# Altium project EMS_Testing_Circuit.PrjPcb
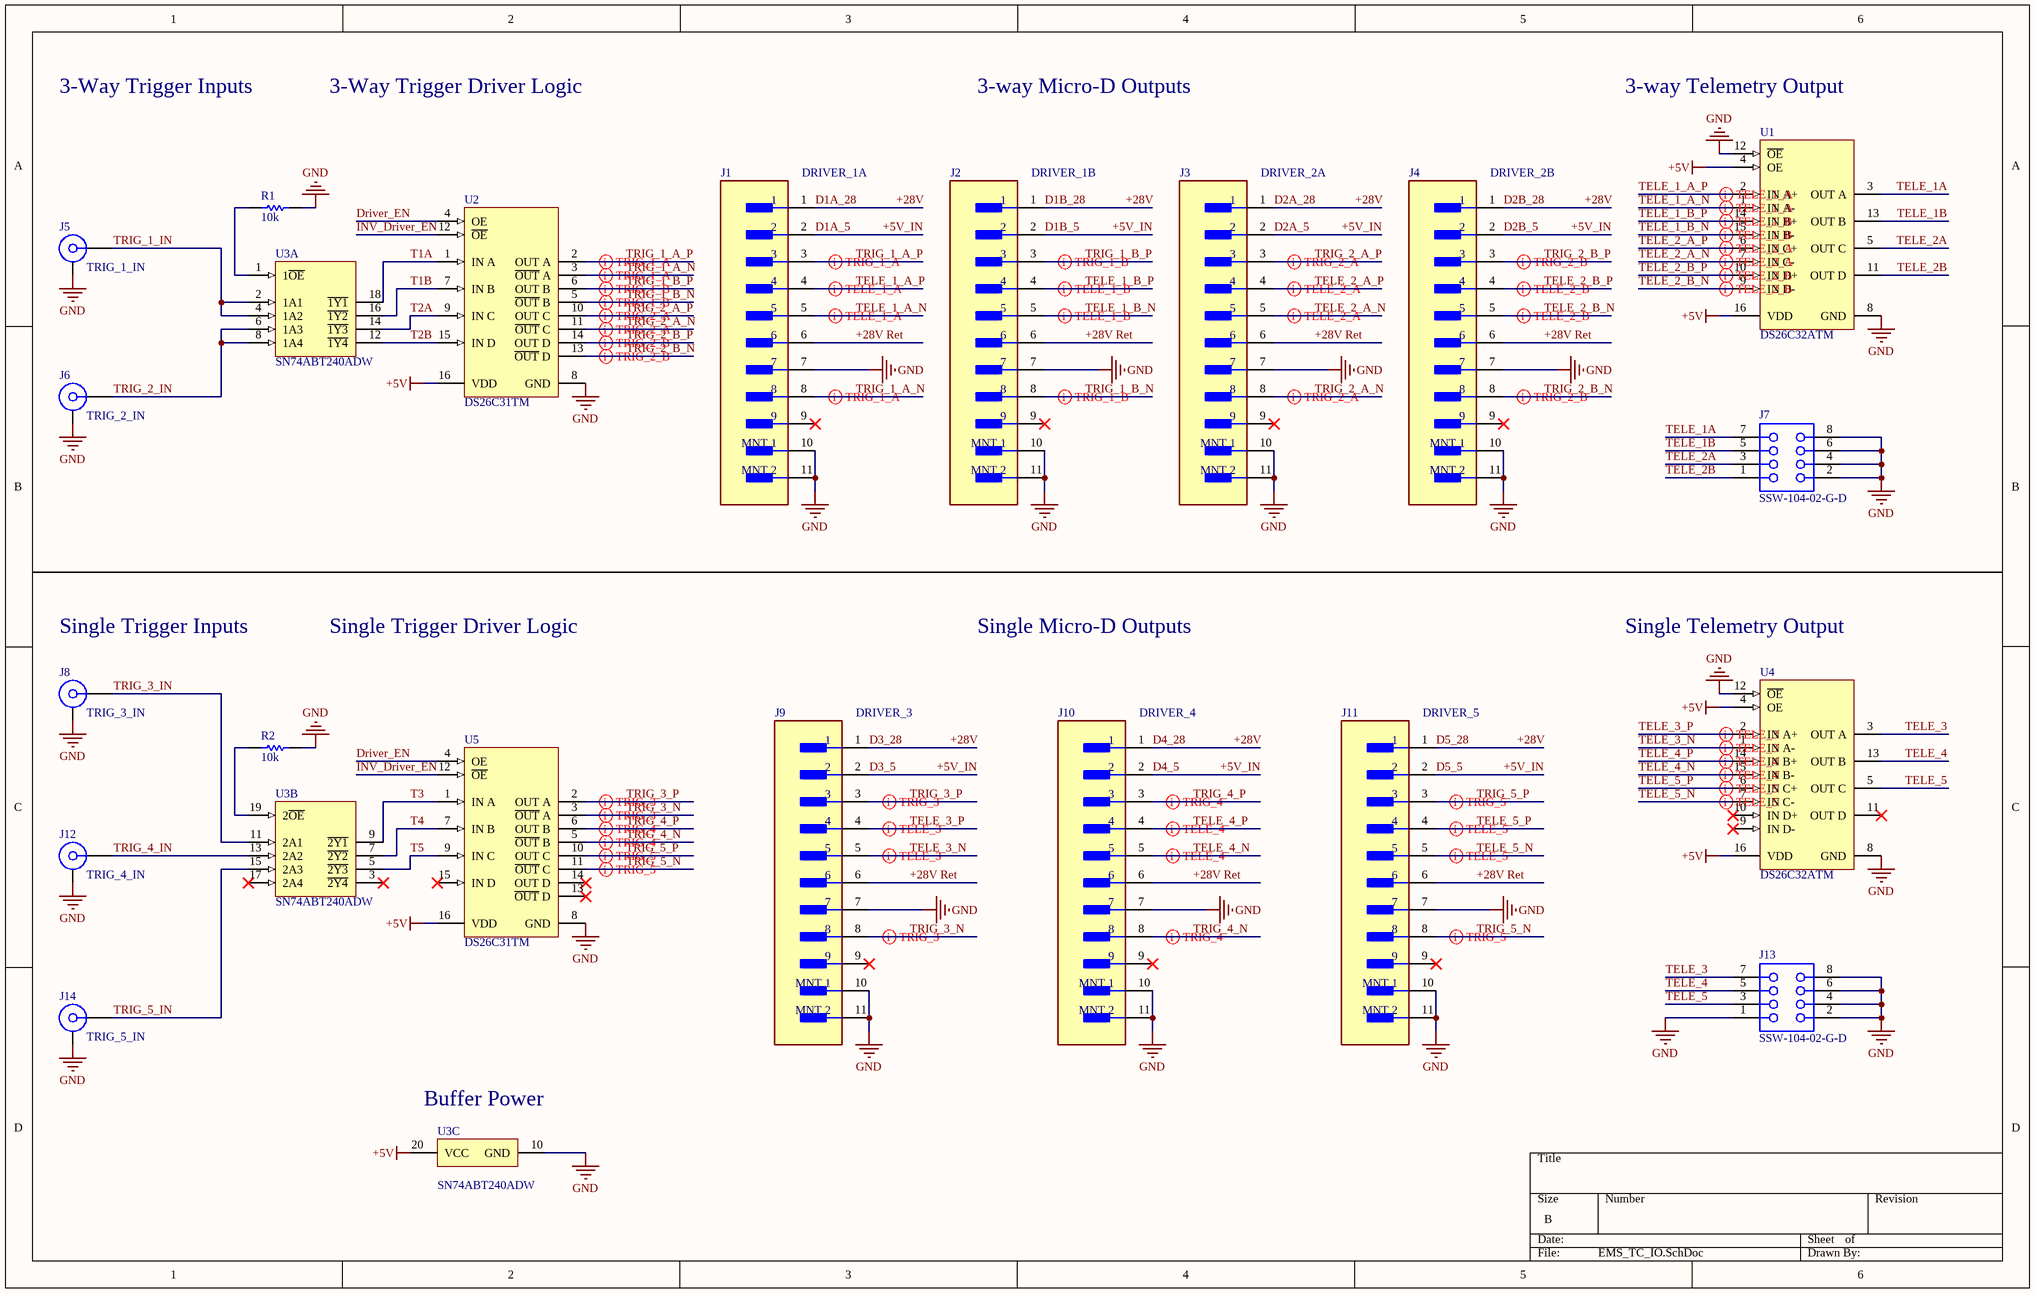
[diagram p0: EMS_TC_IO.SchDoc]
2 sheets, 64 parts. Net scope: global (net labels, ports and power ports of the same name join across sheets).
Board file: EMS_TC_PCB_V2.PcbDoc
Sheets:
  EMS_TC_IO.SchDoc
  EMS_TC_PWR.SchDoc

## Sheet EMS_TC_IO.SchDoc
size B; SheetNumber: 1; SheetTotal: 2

### Parts
J1  DRIVER_1A  [FP-381-009-112L565-MFG]
J2  DRIVER_1B  [FP-381-009-112L565-MFG]
J3  DRIVER_2A  [FP-381-009-112L565-MFG]
J4  DRIVER_2B  [FP-381-009-112L565-MFG]
J5  TRIG_1_IN  [ROS-51K204-400A5_V]
J6  TRIG_2_IN  [ROS-51K204-400A5_V]
J7  SSW-104-02-G-D  [SMTC-SSW-104-02-X-D]
J8  TRIG_3_IN  [ROS-51K204-400A5_V]
J9  DRIVER_3  [FP-381-009-112L565-MFG]
J10  DRIVER_4  [FP-381-009-112L565-MFG]
J11  DRIVER_5  [FP-381-009-112L565-MFG]
J12  TRIG_4_IN  [ROS-51K204-400A5_V]
J13  SSW-104-02-G-D  [SMTC-SSW-104-02-X-D]
J14  TRIG_5_IN  [ROS-51K204-400A5_V]
R1  10k  [RESC3116X65X40ML10T20]
R2  10k  [RESC3116X65X40ML10T20]
U1  DS26C32ATM  [D0016A_L]
U2  DS26C31TM  [D0016A_L]
U3  SN74ABT240ADW  [DW0020A_N]  (parts A,B,C of 3)
U4  DS26C32ATM  [D0016A_L]
U5  DS26C31TM  [D0016A_L]

### Nets
+5V_IN: J1.2 J2.2 J3.2 J4.2 J9.2 J10.2 J11.2 U1.4(OE) U1.16(VDD) U2.16(VDD) U3.20(VCC) U4.4(OE) U4.16(VDD) U5.16(VDD)  [also labelled +5V, D1A_5, D1B_5, D2A_5, D2B_5, D3_5, D4_5, D5_5]
+28V: J1.1 J2.1 J3.1 J4.1 J9.1 J10.1 J11.1  [also labelled D1A_28, D1B_28, D2A_28, D2B_28, D3_28, D4_28, D5_28]
+28V Ret: J1.6 J2.6 J3.6 J4.6 J9.6 J10.6 J11.6
GND: J1.7 J1.10(MNT_1) J1.11(MNT_2) J2.7 J2.10(MNT_1) J2.11(MNT_2) J3.7 J3.10(MNT_1) J3.11(MNT_2) J4.7 J4.10(MNT_1) J4.11(MNT_2) J5.MH J6.MH J7.2 J7.4 J7.6 J7.8 J8.MH J9.7 J9.10(MNT_1) J9.11(MNT_2) J10.7 J10.10(MNT_1) J10.11(MNT_2) J11.7 J11.10(MNT_1) J11.11(MNT_2) J12.MH J13.1 J13.2 J13.4 J13.6 J13.8 J14.MH R1.2 R2.2 U1.8(GND) U1.12(~{OE}) U2.8(GND) U3.10(GND) U4.8(GND) U4.12(~{OE}) U5.8(GND)
Driver_EN: U2.4(OE) U5.4(OE)
INV_Driver_EN: U2.12(~{OE}) U5.12(~{OE})
T1A: U2.1(IN_A) U3.18(~{1Y1})
T1B: U2.7(IN_B) U3.16(~{1Y2})
T2A: U2.9(IN_C) U3.14(~{1Y3})
T2B: U2.15(IN_D) U3.12(~{1Y4})
T3: U3.9(~{2Y1}) U5.1(IN_A)
T4: U3.7(~{2Y2}) U5.7(IN_B)
T5: U3.5(~{2Y3}) U5.9(IN_C)
TELE_1_A_N: J1.5 U1.1(IN_A-)
TELE_1_A_P: J1.4 U1.2(IN_A+)
TELE_1_B_N: J2.5 U1.15(IN_B-)
TELE_1_B_P: J2.4 U1.14(IN_B+)
TELE_1A: J7.7 U1.3(OUT_A)
TELE_1B: J7.5 U1.13(OUT_B)
TELE_2_A_N: J3.5 U1.7(IN_C-)
TELE_2_A_P: J3.4 U1.6(IN_C+)
TELE_2_B_N: J4.5 U1.9(IN_D-)
TELE_2_B_P: J4.4 U1.10(IN_D+)
TELE_2A: J7.3 U1.5(OUT_C)
TELE_2B: J7.1 U1.11(OUT_D)
TELE_3: J13.7 U4.3(OUT_A)
TELE_3_N: J9.5 U4.1(IN_A-)
TELE_3_P: J9.4 U4.2(IN_A+)
TELE_4: J13.5 U4.13(OUT_B)
TELE_4_N: J10.5 U4.15(IN_B-)
TELE_4_P: J10.4 U4.14(IN_B+)
TELE_5: J13.3 U4.5(OUT_C)
TELE_5_N: J11.5 U4.7(IN_C-)
TELE_5_P: J11.4 U4.6(IN_C+)
TRIG_1_A_N: J1.8 U2.3(~{OUT}_A)
TRIG_1_A_P: J1.3 U2.2(OUT_A)
TRIG_1_B_N: J2.8 U2.5(~{OUT}_B)
TRIG_1_B_P: J2.3 U2.6(OUT_B)
TRIG_1_IN: J5.1 U3.2(1A1) U3.4(1A2)
TRIG_2_A_N: J3.8 U2.11(~{OUT}_C)
TRIG_2_A_P: J3.3 U2.10(OUT_C)
TRIG_2_B_N: J4.8 U2.13(~{OUT}_D)
TRIG_2_B_P: J4.3 U2.14(OUT_D)
TRIG_2_IN: J6.1 U3.6(1A3) U3.8(1A4)
TRIG_3_IN: J8.1 U3.11(2A1)
TRIG_3_N: J9.8 U5.3(~{OUT}_A)
TRIG_3_P: J9.3 U5.2(OUT_A)
TRIG_4_IN: J12.1 U3.13(2A2)
TRIG_4_N: J10.8 U5.5(~{OUT}_B)
TRIG_4_P: J10.3 U5.6(OUT_B)
TRIG_5_IN: J14.1 U3.15(2A3)
TRIG_5_N: J11.8 U5.11(~{OUT}_C)
TRIG_5_P: J11.3 U5.10(OUT_C)
NetR1_1: R1.1 U3.1(1~{OE})
NetR2_1: R2.1 U3.19(2~{OE})

Not connected (* = marked no-connect by the designer): J1 9*; J2 9*; J3 9*; J4 9*; J9 9*; J10 9*; J11 9*; U3 3(~{2Y4})* 17(2A4)*; U4 9(IN_D-)* 10(IN_D+)* 11(OUT_D)*; U5 13(~{OUT}_D)* 14(OUT_D)* 15(IN_D)*

### Layout directives
differential pair; differential pair class TRIG_1_A; rule Differential Pairs Routing [Pref Gap = 6mil    Min Gap  = 6mil    Max Gap  = 10milPref Width = 6mil    Min Width  = 6mil    Max Width  = 15mil]: TRIG_1_A_N, TRIG_1_A_P
differential pair; rule Differential Pairs Routing [Pref Gap = 6mil    Min Gap  = 6mil    Max Gap  = 10milPref Width = 6mil    Min Width  = 6mil    Max Width  = 15mil]; differential pair class TRIG_1_B: TRIG_1_B_N, TRIG_1_B_P
differential pair; rule Differential Pairs Routing [Pref Gap = 6mil    Min Gap  = 6mil    Max Gap  = 10milPref Width = 6mil    Min Width  = 6mil    Max Width  = 15mil]; differential pair class TRIG_2_A: TRIG_2_A_N, TRIG_2_A_P
differential pair; rule Differential Pairs Routing [Pref Gap = 6mil    Min Gap  = 6mil    Max Gap  = 10milPref Width = 6mil    Min Width  = 6mil    Max Width  = 15mil]; differential pair class TRIG_2_B: TRIG_2_B_N, TRIG_2_B_P
differential pair; rule Differential Pairs Routing [Pref Gap = 6mil    Min Gap  = 6mil    Max Gap  = 10milPref Width = 6mil    Min Width  = 6mil    Max Width  = 15mil]; differential pair class TELE_1_A: TELE_1_A_N, TELE_1_A_P
differential pair; rule Differential Pairs Routing [Pref Gap = 6mil    Min Gap  = 6mil    Max Gap  = 10milPref Width = 6mil    Min Width  = 6mil    Max Width  = 15mil]; differential pair class TELE_1_B: TELE_1_B_N, TELE_1_B_P
differential pair; differential pair class TELE_2_A; rule Differential Pairs Routing [Pref Gap = 6mil    Min Gap  = 6mil    Max Gap  = 10milPref Width = 6mil    Min Width  = 6mil    Max Width  = 15mil]: TELE_2_A_N, TELE_2_A_P
differential pair; rule Differential Pairs Routing [Pref Gap = 6mil    Min Gap  = 6mil    Max Gap  = 10milPref Width = 6mil    Min Width  = 6mil    Max Width  = 15mil]; differential pair class TELE_2_B: TELE_2_B_N, TELE_2_B_P
differential pair; rule Differential Pairs Routing [Pref Gap = 6mil    Min Gap  = 6mil    Max Gap  = 10milPref Width = 6mil    Min Width  = 6mil    Max Width  = 15mil]; differential pair class TRIG_3: TRIG_3_N, TRIG_3_P
differential pair; rule Differential Pairs Routing [Pref Gap = 6mil    Min Gap  = 6mil    Max Gap  = 10milPref Width = 6mil    Min Width  = 6mil    Max Width  = 15mil]; differential pair class TRIG_4: TRIG_4_N, TRIG_4_P
differential pair; differential pair class TRIG_5; rule Differential Pairs Routing [Pref Gap = 6mil    Min Gap  = 6mil    Max Gap  = 10milPref Width = 6mil    Min Width  = 6mil    Max Width  = 15mil]: TRIG_5_N, TRIG_5_P
differential pair; differential pair class TELE_3; rule Differential Pairs Routing [Pref Gap = 6mil    Min Gap  = 6mil    Max Gap  = 10milPref Width = 6mil    Min Width  = 6mil    Max Width  = 15mil]: TELE_3_N, TELE_3_P
differential pair; differential pair class TELE_4; rule Differential Pairs Routing [Pref Gap = 6mil    Min Gap  = 6mil    Max Gap  = 10milPref Width = 6mil    Min Width  = 6mil    Max Width  = 15mil]: TELE_4_N, TELE_4_P
differential pair; differential pair class TELE_5; rule Differential Pairs Routing [Pref Gap = 6mil    Min Gap  = 6mil    Max Gap  = 10milPref Width = 6mil    Min Width  = 6mil    Max Width  = 15mil]: TELE_5_N, TELE_5_P

### Notes on the sheet
- 3-Way Trigger Inputs
- 3-Way Trigger Driver Logic
- 3-way Micro-D Outputs
- 3-way Telemetry Output
- Single Trigger Inputs
- Single Trigger Driver Logic
- Single Micro-D Outputs
- Single Telemetry Output
- (near U3) Buffer Power

### Library data of the parts
J1-J4 J9-J11 = CMP-42562-000005-1: CONN MICRO-D PLUG 9POS R/A SLDR; Manufacturer Part Number: 381-009-112L565; Manufacturer: NorComp Inc.; Conn Orientation: Right Angle; Voltage Rating: 500V; Conn Gender: Male; Number Of Contacts: 9; Shielding: true; Pitch: 1.27mm; Current Rating: 1A; RoHS: TRUE; Temperature Range Low: -55°C; Digikey Description: CONN MICRO-D PLUG 9POS R/A SLDR; ComponentLink2Description: Datasheet; Category: Conn; Octopart: https://octopart.com/381-009-112l565-norcomp-21388372; Automotive: No; Device Class L3: unset; Package: 381-009-112L565; Height: 8.003mm; Device Class L2: D-Sub Connectors; ComponentLink2URL: https://www.norcomp.net/rohspdfs/Micro-D/381-009-112L565.pdf; Contact Material: Gold,Nickel; Mouser Description: D-Sub Micro-D Connectors MICRO-D 9P R/A W/ STNDOFF/BRDLK; Temperature: -55°C to +85°C; Temperature Range High: +85°C; Device Class L1: Connectors; Lead Free: Yes
J5 J6 J8 J12 J14 = CMP-0753-00004-1: BNC 50R Right Angle Jack, Panel Feedthrough, Up to 10 GHz, -55 to 155 degC; PartNumber: 51K204-400A5; Manufacturer: Rosenberger; Design Note: Footprint in library is a generic example - only application specific footprint delivers High Performance; PackageReference: 51K204-400A5; DatasheetVersion: d00; ComponentLink2Description: Datasheet; ComponentLink5Description: Webshop / RFQ; ComponentLink1URL: http://www.rosenberger.de; ComponentLink4URL: http://rosenberger.de/ok/images/documents/spez/51.pdf; PackageVersion: d00; ComponentLink5URL: http://www.rosenberger.com/en/contact/sales/; ComponentLink3URL: http://rosenberger.de/ok/images/documents/db/51K204-400A5.pdf; ComponentLink2URL: http://rosenberger.de/ok/images/documents/db/51K204-400A5.pdf; ComponentLink1Description: Manufacturer URL; Mounting Technology: Through Hole; PackageDescription: 50R BNC Right Angle Jack, 12.5 x 32.6 x 14.5 mm; ComponentLink4Description: Series Overview / Design Note; ComponentLink3Description: Package Specification
J7 J13 = CMP-1023-00343-1: SQ Post Socket, Through-hole, Vertical, -55 to 125 degC, 2.54mm Pitch, 8-Pin, Female, RoHS; Manufacturer: Samtec; Mounting Technology: Through-hole; ComponentLink1Description: Manufacturer URL; Orientation: Vertical; Pitch: 2.54 mm; PartNumber: SSW-104-02-G-D; ComponentLink2URL: http://www.samtec.com/documents/webfiles/pdf/SSW_TH.PDF; PackageReference: SSW-104-02-X-D; ComponentLink3Description: Package Specification; PackageVersion: CA, 6/1987; PackageDescription: Assembly, Socket Strip .016 X .031 Tail; ComponentLink2Description: Datasheet; RoHS: True; ComponentLink1URL: http://www.samtec.com; ComponentLink3URL: http://www.samtec.com/documents/webfiles/cpdf/SSW-1XX-XX-XXX-X-XX-XXX-XX-MKT.pdf; DatasheetVersion: F-214; Temperature Range: -55 to 125 degC
R1 R2 = CMP-1014-00623-2: Chip Resistor, 10 KOhm, +/- 1%, 0.25 W, -55 to 155 degC, 1206 (3216 Metric), RoHS, Tape and Reel; Manufacturer: Yageo; Voltage Rating: 200V; Resistance: 10KOhm; Temperature Coefficient: 100ppm/degreesC; Power Rating: 250mW; Packaging: TapeandReel; Termination: SMD/SMT; REACH SVHC: Unknown; Tolerance: 1%; Height: 0.55mm; Composition: ThickFilm; Max Operating Temperature: 155degC; Datasheet Version: Rev. 5, 10/2016; Lead Free: LeadFree; Case Code (Metric): 3216; Depth: 1.6mm; Package Quantity: 5000; RoHSCompliant: true; Military Standard: Not; Case/Package: 1206; Case Code (Imperial): 1206; Min Operating Temperature: -55degC; Datasheet URL: http://www.yageo.com/NewPortal/yageodocoutput?fileName=/pdf/R-Chip/PYu-RC_Group_51_RoHS_L_5.pdf; Length: 3.1mm; Manufacturer URL: http://www.yageo.com/; Package Reference: 1206.0; Width: 1.6mm; Package Description: 2-Pin Surface Mount Device, Body 3.1 x 1.6 mm
U1 U4 = CMP-0058-00986-3: CMOS Quad Differential Line Receiver, 16-pin Narrow SOIC; Manufacturer: Texas Instruments; CompType: Interface IC; PowerWise: N; PackageTopMarking: NSUZXYTTE#*DS26C32ATM; Code_JEDEC: MS-012-AC; ComponentLink1Description: Datasheet URL; RoHS: N; Code_IPC: SOIC127P600-16; PackageReference: D0016A; PinCount: 16; ComponentLink1URL: http://www.ti.com/general/docs/lit/getliterature.tsp?genericPartNumber=DS26C32AT&fileType=pdf; PackageDescription: Molded Package, SO, .150in Wide, 16 Lead
U2 U5 = CMP-0058-00990-3: CMOS Quad Tri-State Differential Line Driver, 16-pin Narrow SOIC; Manufacturer: Texas Instruments; CompType: Interface IC; PackageTopMarking: NSUZXYTTE#*DS26C31TM; PowerWise: N; PinCount: 16; ComponentLink1URL: http://www.ti.com/general/docs/lit/getliterature.tsp?genericPartNumber=DS26C31T&fileType=pdf; PackageDescription: Molded Package, SO, .150in Wide, 16 Lead; Code_JEDEC: MS-012-AC; ComponentLink1Description: Datasheet URL; RoHS: N; Code_IPC: SOIC127P600-16; PackageReference: D0016A
U3 = CMP-1615-00030-3: Octal Buffers/Drivers With 3-State Outputs, DW0020A, TUBE; Manufacturer: Texas Instruments; Schmitt Trigger: No; Voltage(Nom)(V): 5; VCC(Max)(V): 5.5; Input Type: TTL; tpd @ Nom Voltage(Max)(ns): 4.8; Bits(#): 8; Rating: Catalog; F @ Nom Voltage(Max)(Mhz): 150; Output Drive (IOL/IOH)(Max)(mA): -32/64; ICC @ Nom Voltage(Max)(mA): 0.0055; VCC(Min)(V): 4.5; Technology Family: ABT; PackageReference: DW0020A; Generic Part Number: SN74ABT240A; Code_JEDEC: MS-013; DatasheetVersion: SCBS098I; Operating Temperature Range(C): -40 to 85; Output Type: TTL

## Sheet EMS_TC_PWR.SchDoc
size B; SheetNumber: 2; SheetTotal: 2
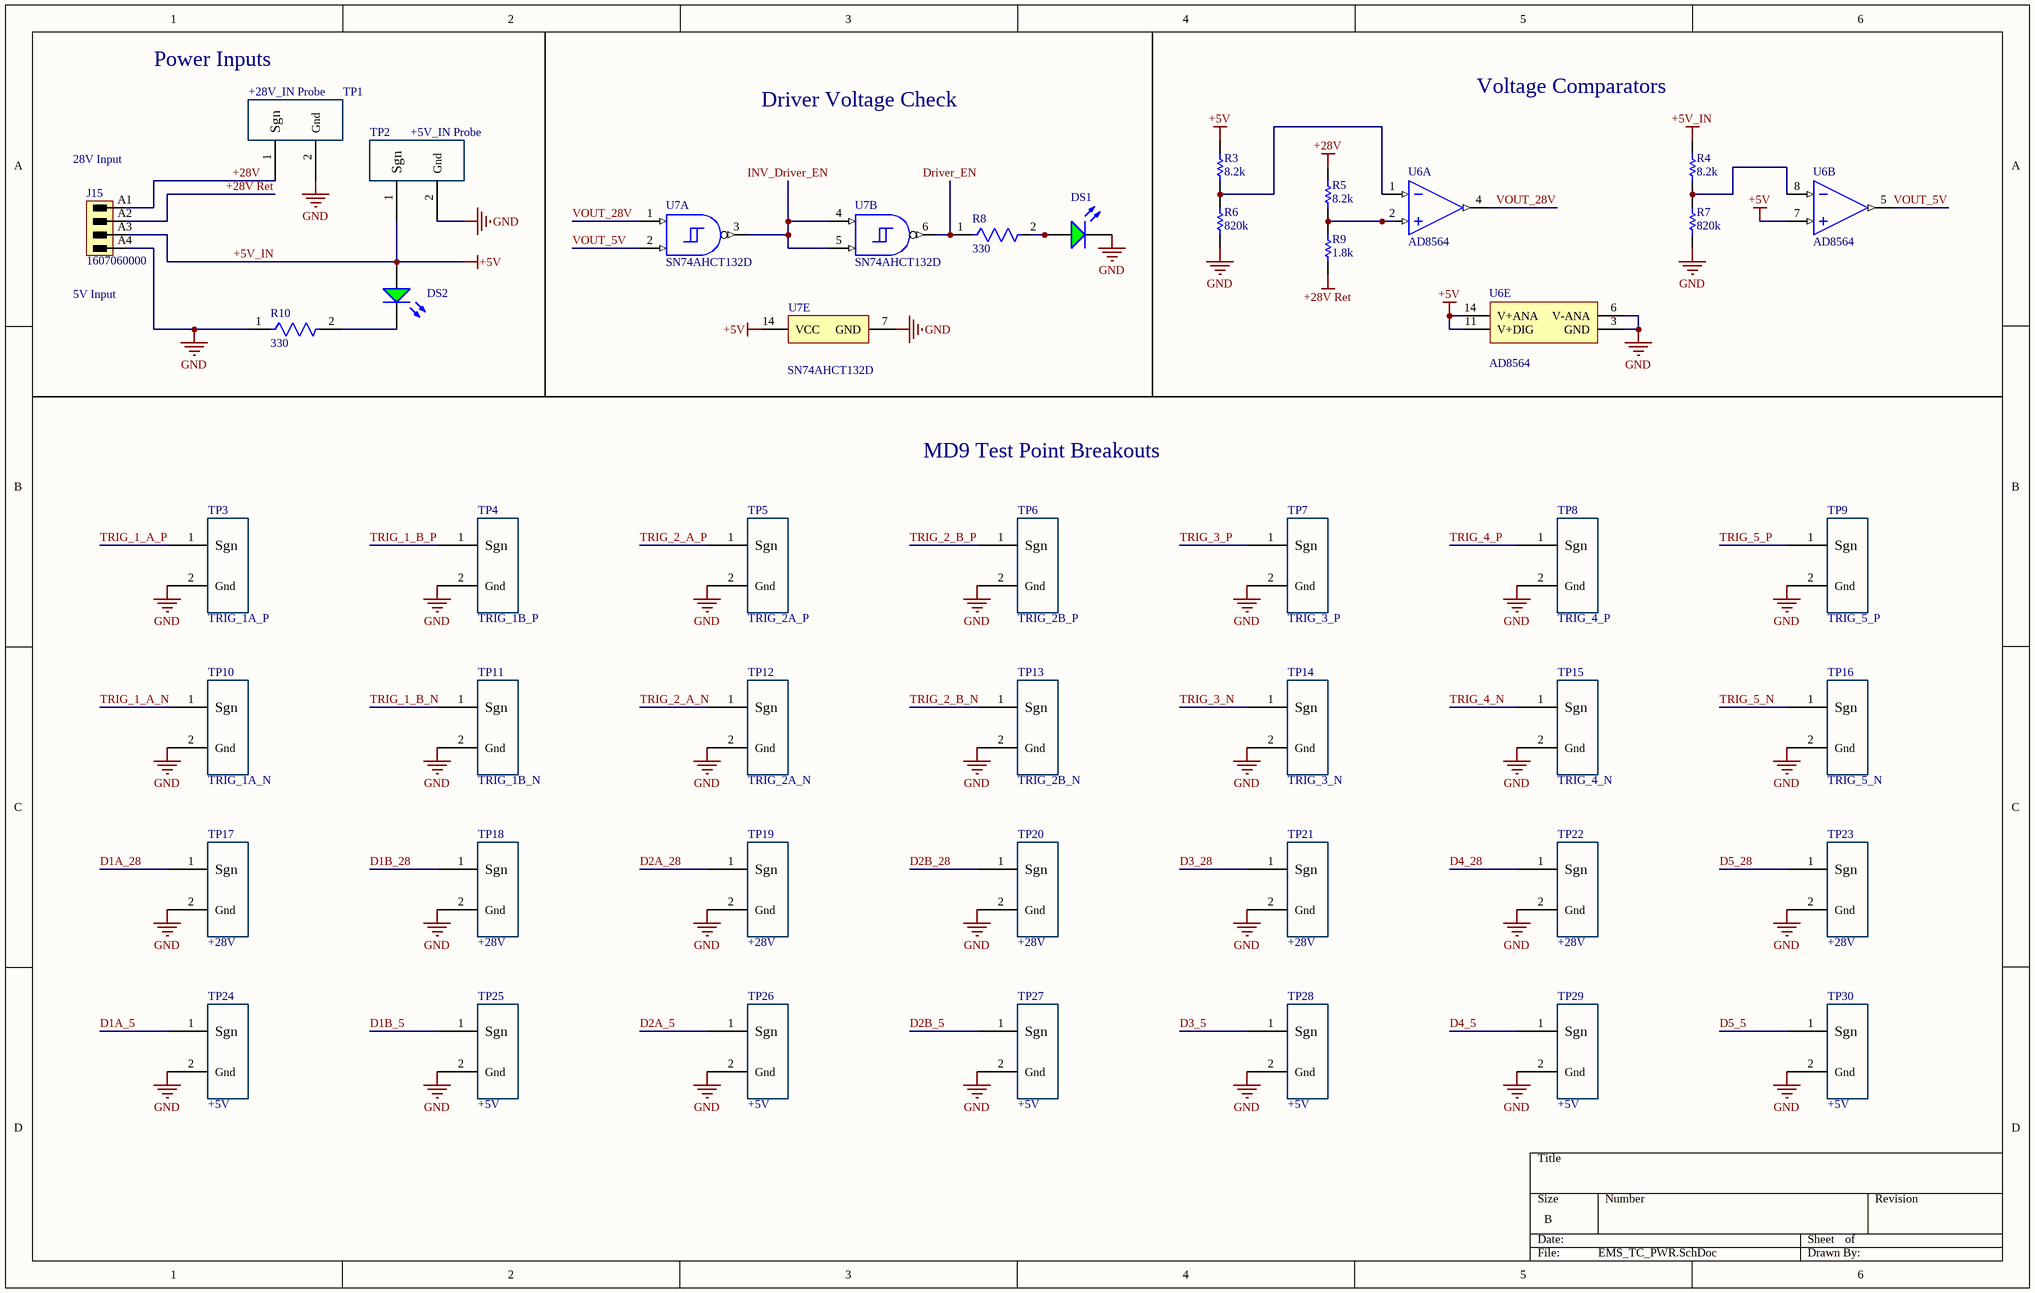
[diagram p1: EMS_TC_PWR.SchDoc]

### Parts
DS1  SML-LX1206GC-TR  [LUMX-SML-LX1206GC-TR_V]  (value not drawn)
DS2  SML-LX1206GC-TR  [LUMX-SML-LX1206GC-TR_V]  (value not drawn)
J15  1607060000  [SL_3_50_90F_04]
R3  8.2k  [RESC3216X70X50LL05T20]
R4  8.2k  [RESC3216X70X50LL05T20]
R5  8.2k  [RESC3216X70X50LL05T20]
R6  820k  [RESC3216X70X50LL20T25]
R7  820k  [RESC3216X70X50LL20T25]
R8  330  [FP-CRCW1206-e3-IPC_A]
R9  1.8k  [RESC3216X70X50LL05T20]
R10  330  [FP-CRCW1206-e3-IPC_A]
TP1  +28V_IN Probe  [TDR_Probe]
TP2  +5V_IN Probe  [TDR_Probe]
TP3  TRIG_1A_P  [TDR_Probe]
TP4  TRIG_1B_P  [TDR_Probe]
TP5  TRIG_2A_P  [TDR_Probe]
TP6  TRIG_2B_P  [TDR_Probe]
TP7  TRIG_3_P  [TDR_Probe]
TP8  TRIG_4_P  [TDR_Probe]
TP9  TRIG_5_P  [TDR_Probe]
TP10  TRIG_1A_N  [TDR_Probe]
TP11  TRIG_1B_N  [TDR_Probe]
TP12  TRIG_2A_N  [TDR_Probe]
TP13  TRIG_2B_N  [TDR_Probe]
TP14  TRIG_3_N  [TDR_Probe]
TP15  TRIG_4_N  [TDR_Probe]
TP16  TRIG_5_N  [TDR_Probe]
TP17  +28V  [TDR_Probe]
TP18  +28V  [TDR_Probe]
TP19  +28V  [TDR_Probe]
TP20  +28V  [TDR_Probe]
TP21  +28V  [TDR_Probe]
TP22  +28V  [TDR_Probe]
TP23  +28V  [TDR_Probe]
TP24  +5V  [TDR_Probe]
TP25  +5V  [TDR_Probe]
TP26  +5V  [TDR_Probe]
TP27  +5V  [TDR_Probe]
TP28  +5V  [TDR_Probe]
TP29  +5V  [TDR_Probe]
TP30  +5V  [TDR_Probe]
U6  AD8564  [ADI-RU-16_L]  (parts A,B,E of 5)
U7  SN74AHCT132D  [D0014A_L]  (parts A,B,E of 5)

### Nets
+5V_IN: DS2.1(A) J15.A3 R3.2 R4.2 TP2.1(Sgn) TP24.1(Sgn) TP25.1(Sgn) TP26.1(Sgn) TP27.1(Sgn) TP28.1(Sgn) TP29.1(Sgn) TP30.1(Sgn) U6.7(+INB) U6.11(V+DIG) U6.14(V+ANA) U7.14(VCC)  [also labelled +5V, D1A_5, D1B_5, D2A_5, D2B_5, D3_5, D4_5, D5_5]
+28V: J15.A1 R5.2 TP1.1(Sgn) TP17.1(Sgn) TP18.1(Sgn) TP19.1(Sgn) TP20.1(Sgn) TP21.1(Sgn) TP22.1(Sgn) TP23.1(Sgn)  [also labelled D1A_28, D1B_28, D2A_28, D2B_28, D3_28, D4_28, D5_28]
+28V Ret: J15.A2 R9.1
GND: DS1.2(K) J15.A4 R6.1 R7.1 R10.1 TP1.2(Gnd) TP2.2(Gnd) TP3.2(Gnd) TP4.2(Gnd) TP5.2(Gnd) TP6.2(Gnd) TP7.2(Gnd) TP8.2(Gnd) TP9.2(Gnd) TP10.2(Gnd) TP11.2(Gnd) TP12.2(Gnd) TP13.2(Gnd) TP14.2(Gnd) TP15.2(Gnd) TP16.2(Gnd) TP17.2(Gnd) TP18.2(Gnd) TP19.2(Gnd) TP20.2(Gnd) TP21.2(Gnd) TP22.2(Gnd) TP23.2(Gnd) TP24.2(Gnd) TP25.2(Gnd) TP26.2(Gnd) TP27.2(Gnd) TP28.2(Gnd) TP29.2(Gnd) TP30.2(Gnd) U6.3(GND) U6.6(V-ANA) U7.7(GND)
Driver_EN: R8.1 U7.6(2Y)
INV_Driver_EN: U7.3(1Y) U7.4(2A) U7.5(2B)
TRIG_1_A_N: TP10.1(Sgn)
TRIG_1_A_P: TP3.1(Sgn)
TRIG_1_B_N: TP11.1(Sgn)
TRIG_1_B_P: TP4.1(Sgn)
TRIG_2_A_N: TP12.1(Sgn)
TRIG_2_A_P: TP5.1(Sgn)
TRIG_2_B_N: TP13.1(Sgn)
TRIG_2_B_P: TP6.1(Sgn)
TRIG_3_N: TP14.1(Sgn)
TRIG_3_P: TP7.1(Sgn)
TRIG_4_N: TP15.1(Sgn)
TRIG_4_P: TP8.1(Sgn)
TRIG_5_N: TP16.1(Sgn)
TRIG_5_P: TP9.1(Sgn)
VOUT_5V: U6.5(OUT_B) U7.2(1B)
VOUT_28V: U6.4(OUT_A) U7.1(1A)
NetDS1_1: DS1.1(A) R8.2
NetDS2_2: DS2.2(K) R10.2
NetR3_1: R3.1 R6.2 U6.1(-INA)
NetR4_1: R4.1 R7.2 U6.8(-INB)
NetR5_1: R5.1 R9.2 U6.2(+INA)

### Notes on the sheet
- Power Inputs
- Voltage Comparators
- (near J15) 28V Input
- Driver Voltage Check
- (near J15) 5V Input
- MD9 Test Point Breakouts

### Library data of the parts
DS1 DS2 = CMP-2000-07122-1: Green Led, Water Clear Lens, 10 mcd, 565 nm, 2.2 V, -40 to 85 degC, 2-Pin SMD, RoHS, Tape and Reel; Manufacturer: Lumex; Number of LEDs: 1; Type: Uni-Color; Viewing Angle: 160; Pin_Count: 2; Intensity: 10mcd; Reverse Voltage: 5(Min)V; COO: CN; LED Material: GaP; Peak Wavelength: 565nm; Lens Appearance: ColorlessNonDiffused; Datasheet Version: Rev. J, 04/2011; Package Description: 2-Pin Surface Mount Device, Body 3.2 x 1.6 mm; Part No: SML-LX1206GC-TR; Lens Dimensions: 2x1.6x0.5mm; Dimension: 3.2x1.6x1.1mm; Color: Green; Supplier: Lumex; Supplier Standard Pack: 3,000; Manufacturer URL: http://www.lumexinstruments.com/; Dominant Wavelength: N/A; ECCN: EAR99; Datasheet URL: http://www.mouser.com/ds/2/244/SML-LX1206GC-TR-112732.pdf; HTS: 8541402000; Mounting: SurfaceMount; Package Reference: SML-LX1206GC-TR; Family: SML-LX1206GC; Packaging: TapeandReel; RoHS: Yes; Operating Temperature: -40to85C; Supplier_Package: SMD; Mounting Technology: SurfaceMount
J15 = CMP-1559-00921-1: OMNIMATE Signal - series BL/SL 3.50; Manufacturer: Weidmueller; Side_termination_characteristic: Flange; Rated_voltage_for_surge_voltage_class_pollution_degree_II_2: 320 V; No_of_poles: 4; Contact_material: CuSn; Mounting_onto_the_PCB: Solder connection; Short_text_for_material: SL 3.50/04/90F 3.2SN OR BX; Rated_voltage_use_group_B_UL_1059: 300 V; Contact_surface: tinned; Rated_current_min_no_of_poles_TU_20_deg_C: 32 A; Rated_current_use_group_B_UL_1059: 10 A; Pitch_inch: 0.138 inch; Outgoing_elbow: 90°; Insulating_material: PBT; Pitch_mm: 3.5 mm; Solder_pin_length_mm: 3.2 mm; UL_94_flammability_rating: V-0; Colour: Orange; Revision: V1; PartNumber: 1607060000; Packaging: Box; Qty: 100 PCS; PackageReference: SL_3_50_90F_04; ComponentLink1Description: Manufacturer URL; ComponentLink2Description: URL Link1; ComponentLink2URL: http://catalog.weidmueller.com/catalog/Start.do?localeId=en&ObjectID=1607060000; ComponentLink1URL: http://www.weidmueller.com/
R3-R5 = CMP-2003-00870-1: Manufacturer: Panasonic; Part Number: ERJ8ENF8201V
R6 R7 = CMP-2003-00010-1: Manufacturer: Panasonic; Part Number: ERA8AEB824V
R8 R10 = CMP-2003-02098-2: RES Thick Film, 330Ω, 1%, 0.25W, 100ppm/°C, 1206; Voltage Rating: 200V; Resistance: 330R; Max Power Dissipation: 250mW; Height: 0.55mm; Mount: Surface Mount; Min Operating Temperature: -55°C; Depth: 1.6mm; Features: Automotive AEC-Q200; Voltage Rating (DC): 200V; Military Standard: Not; Packaging: Tape and Reel; Composition: Thick Film; Contact Plating: Tin; Case Code (Imperial): 1206; Case/Package: 1206; Number of Terminations: 2; Length: 3.2mm; Lead Free: Lead Free; Tolerance: 1%; Temperature Coefficient: 100ppm/°C; Case Code (Metric): 3216; Width: 1.6mm; Weight: 0.000353oz; Termination: SMD/SMT; Radiation Hardening: No; Package Quantity: 10; Power Rating: 250mW; Max Operating Temperature: 155°C
R9 = CMP-2003-00168-1: Part Number: ERJ8ENF1801V; Manufacturer: Panasonic
TP1-TP30 = TP_TDR: Small Pad Holes for the TDR Probes
U6 = CMP-0783-00155-1: Quad Single Supply Comparator, 5 V, 7 ns Delay, Industrial, 16-pin SOP (RU-16), Reel; Manufacturer: Analog Devices; PartNumber: AD8564ARUZ-REEL; Voltage Supply (V): +/- 5; Input Range (V): -4.9 to 3.5; Total Power (mW): 150mW; ComponentLink4URL: Product URL:http://www.analog.com/en/special-linear-functions/comparators/ad8564/products/product.html; ComponentLink2Description: Datasheet; Packing: Reel; ComponentLink2URL: http://www.analog.com/static/imported-files/data_sheets/AD8564.pdf; ComponentLink1Description: Manufacturer URL; PackageVersion: Nov-02; Mounting Technology: Surface Mount; PackageDescription: 16-Pin Thin Shrink Small Outline Package, Body 5 x 4.4 mm, Pitch 0.65 mm; ComponentLink3URL: http:/www.analog.com/static/imported-files/packages/36244347913743854010197452789RU16.pdf; ComponentLink1URL: http://www.analog.com/en/index.html; Code_JEDEC: MO-153AB; DatasheetVersion: Rev. B; ComponentLink4Description: URL Link1; ComponentLink3Description: Package Specification; PackageReference: RU-16
U7 = CMP-1627-00035-3: Quadruple Positive-NAND Gates With Schmitt-Trigger Inputs, D0014A, TUBE; Manufacturer: Texas Instruments; Output Drive (IOL/IOH)(Max)(mA): 8/-8; Rating: Catalog; tpd @ Nom Voltage(Max)(ns): 10; VCC(Min)(V): 4.5; ICC @ Nom Voltage(Max)(mA): 0.02; VCC(Max)(V): 5.5; Bits(#): 4; Input Type: TTL; Schmitt Trigger: Yes; Technology Family: AHCT; Voltage(Nom)(V): 5; Output Type: CMOS; F @ Nom Voltage(Max)(Mhz): 70; Generic Part Number: SN74AHCT132; Code_JEDEC: MS-012; Operating Temperature Range(C): -40 to 85; DatasheetVersion: SCLS366G; PackageReference: D0014A

## Nets that join several sheets
+5V_IN: EMS_TC_IO (14 pins), EMS_TC_PWR (16 pins)
+28V: EMS_TC_IO (7 pins), EMS_TC_PWR (10 pins)
+28V Ret: EMS_TC_IO (7 pins), EMS_TC_PWR (J15.A2 R9.1)
GND: EMS_TC_IO (44 pins), EMS_TC_PWR (38 pins)
Driver_EN: EMS_TC_IO (U2.4 U5.4), EMS_TC_PWR (R8.1 U7.6)
INV_Driver_EN: EMS_TC_IO (U2.12 U5.12), EMS_TC_PWR (U7.3 U7.4 U7.5)
TRIG_1_A_N: EMS_TC_IO (J1.8 U2.3), EMS_TC_PWR (TP10.1)
TRIG_1_A_P: EMS_TC_IO (J1.3 U2.2), EMS_TC_PWR (TP3.1)
TRIG_1_B_N: EMS_TC_IO (J2.8 U2.5), EMS_TC_PWR (TP11.1)
TRIG_1_B_P: EMS_TC_IO (J2.3 U2.6), EMS_TC_PWR (TP4.1)
TRIG_2_A_N: EMS_TC_IO (J3.8 U2.11), EMS_TC_PWR (TP12.1)
TRIG_2_A_P: EMS_TC_IO (J3.3 U2.10), EMS_TC_PWR (TP5.1)
TRIG_2_B_N: EMS_TC_IO (J4.8 U2.13), EMS_TC_PWR (TP13.1)
TRIG_2_B_P: EMS_TC_IO (J4.3 U2.14), EMS_TC_PWR (TP6.1)
TRIG_3_N: EMS_TC_IO (J9.8 U5.3), EMS_TC_PWR (TP14.1)
TRIG_3_P: EMS_TC_IO (J9.3 U5.2), EMS_TC_PWR (TP7.1)
TRIG_4_N: EMS_TC_IO (J10.8 U5.5), EMS_TC_PWR (TP15.1)
TRIG_4_P: EMS_TC_IO (J10.3 U5.6), EMS_TC_PWR (TP8.1)
TRIG_5_N: EMS_TC_IO (J11.8 U5.11), EMS_TC_PWR (TP16.1)
TRIG_5_P: EMS_TC_IO (J11.3 U5.10), EMS_TC_PWR (TP9.1)